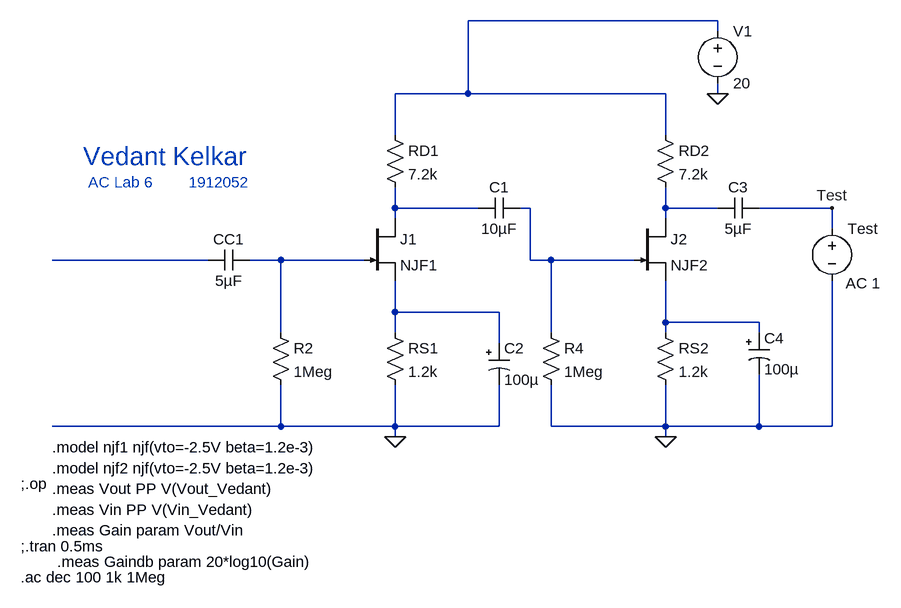
[diagram p0: schematic AC2_lab6.asc]
AC2_lab6.asc, the LTspice schematic file:
Version 4
SHEET 1 1384 840
WIRE 1040 -32 656 -32
WIRE 1040 -16 1040 -32
WIRE 656 80 656 -32
WIRE 656 80 544 80
WIRE 960 80 656 80
WIRE 1040 80 1040 64
WIRE 544 144 544 80
WIRE 960 144 960 80
WIRE 544 256 544 224
WIRE 672 256 544 256
WIRE 752 256 736 256
WIRE 960 256 960 224
WIRE 1040 256 960 256
WIRE 1216 256 1104 256
WIRE 544 272 544 256
WIRE 960 272 960 256
WIRE 1216 288 1216 256
WIRE 256 336 16 336
WIRE 368 336 320 336
WIRE 496 336 368 336
WIRE 752 336 752 256
WIRE 784 336 752 336
WIRE 912 336 784 336
WIRE 544 416 544 368
WIRE 704 416 544 416
WIRE 960 432 960 368
WIRE 1104 432 960 432
WIRE 368 448 368 336
WIRE 544 448 544 416
WIRE 784 448 784 336
WIRE 960 448 960 432
WIRE 1104 448 1104 432
WIRE 704 464 704 416
WIRE 368 592 368 528
WIRE 368 592 16 592
WIRE 544 592 544 528
WIRE 544 592 368 592
WIRE 704 592 704 528
WIRE 704 592 544 592
WIRE 784 592 784 528
WIRE 960 592 960 528
WIRE 960 592 784 592
WIRE 1104 592 1104 512
WIRE 1104 592 960 592
WIRE 1216 592 1216 368
WIRE 1216 592 1104 592
WIRE 544 608 544 592
WIRE 960 608 960 592
FLAG 544 608 0
FLAG 960 608 0
FLAG 1040 80 0
FLAG 1216 256 Test
SYMBOL res 528 128 R0
SYMATTR InstName RD1
SYMATTR Value 7.2k
SYMBOL res 528 432 R0
SYMATTR InstName RS1
SYMATTR Value 1.2k
SYMBOL res 352 432 R0
SYMATTR InstName R2
SYMATTR Value 1Meg
SYMBOL cap 320 320 R90
WINDOW 0 0 32 VBottom 2
WINDOW 3 32 32 VTop 2
SYMATTR InstName CC1
SYMATTR Value 5µF
SYMBOL voltage 1216 272 R0
WINDOW 123 21 100 Left 2
WINDOW 39 0 0 Left 0
WINDOW 3 6 100 Left 2
SYMATTR Value2 AC 1
SYMATTR Value ""
SYMATTR InstName Test
SYMBOL cap 736 240 R90
WINDOW 0 0 32 VBottom 2
WINDOW 3 32 32 VTop 2
SYMATTR InstName C1
SYMATTR Value 10µF
SYMBOL polcap 688 464 R0
WINDOW 3 24 56 Left 2
SYMATTR Value 100µ
SYMATTR InstName C2
SYMATTR Description Capacitor
SYMATTR Type cap
SYMATTR SpiceLine V=4 Irms=3.72678 Rser=0.018 Lser=0 mfg="KEMET" pn="A700D107M004ATE018" type="Al electrolytic"
SYMBOL res 768 432 R0
SYMATTR InstName R4
SYMATTR Value 1Meg
SYMBOL res 944 128 R0
SYMATTR InstName RD2
SYMATTR Value 7.2k
SYMBOL res 944 432 R0
SYMATTR InstName RS2
SYMATTR Value 1.2k
SYMBOL cap 1104 240 R90
WINDOW 0 0 32 VBottom 2
WINDOW 3 32 32 VTop 2
SYMATTR InstName C3
SYMATTR Value 5µF
SYMBOL polcap 1088 448 R0
WINDOW 3 24 56 Left 2
SYMATTR Value 100µ
SYMATTR InstName C4
SYMATTR Description Capacitor
SYMATTR Type cap
SYMATTR SpiceLine V=4 Irms=3.72678 Rser=0.018 Lser=0 mfg="KEMET" pn="A700D107M004ATE018" type="Al electrolytic"
SYMBOL voltage 1040 -32 R0
WINDOW 123 0 0 Left 0
WINDOW 39 0 0 Left 0
SYMATTR InstName V1
SYMATTR Value 20
SYMBOL njf 496 272 R0
SYMATTR InstName J1
SYMATTR Value NJF1
SYMBOL njf 912 272 R0
SYMATTR InstName J2
SYMATTR Value NJF2
TEXT 64 176 Left 4 ;Vedant Kelkar
TEXT 72 216 Left 2 ;AC Lab 6        1912052
TEXT 16 624 Left 2 !.model njf1 njf(vto=-2.5V beta=1.2e-3)
TEXT 16 656 Left 2 !.model njf2 njf(vto=-2.5V beta=1.2e-3)
TEXT -32 680 Left 2 !;.op
TEXT 16 688 Left 2 !.meas Vout PP V(Vout_Vedant)
TEXT 16 720 Left 2 !.meas Vin PP V(Vin_Vedant)
TEXT 16 752 Left 2 !.meas Gain param Vout/Vin
TEXT -32 776 Left 2 !;.tran 0.5ms
TEXT 24 800 Left 2 !.meas Gaindb param 20*log10(Gain)
TEXT -32 824 Left 2 !.ac dec 100 1k 1Meg

The netlist it stands for:
* AC2_lab6.asc
RD1 N001 N002 7.2k
RS1 N007 0 1.2k
R2 N006 0 1Meg
CC1 N006 N005 5µF
V§Test Test 0 AC 1
C1 N003 N002 10µF
C2 N007 0 100µ V=4 Irms=3.72678 Rser=0.018 Lser=0 mfg="KEMET" pn="A700D107M004ATE018" type="Al electrolytic"
R4 N003 0 1Meg
RD2 N001 N004 7.2k
RS2 N008 0 1.2k
C3 Test N004 5µF
C4 N008 0 100µ V=4 Irms=3.72678 Rser=0.018 Lser=0 mfg="KEMET" pn="A700D107M004ATE018" type="Al electrolytic"
V1 N001 0 20
J1 N002 N006 N007 NJF1
J2 N004 N003 N008 NJF2
.model NJF NJF
.model PJF PJF
.lib standard.jft
* Vedant Kelkar
* AC Lab 6        1912052
.model njf1 njf(vto=-2.5V beta=1.2e-3)
.model njf2 njf(vto=-2.5V beta=1.2e-3)
;.op
.meas Vout PP V(Vout_Vedant)
.meas Vin PP V(Vin_Vedant)
.meas Gain param Vout/Vin
;.tran 0.5ms
.meas Gaindb param 20*log10(Gain)
.ac dec 100 1k 1Meg
.backanno
.end